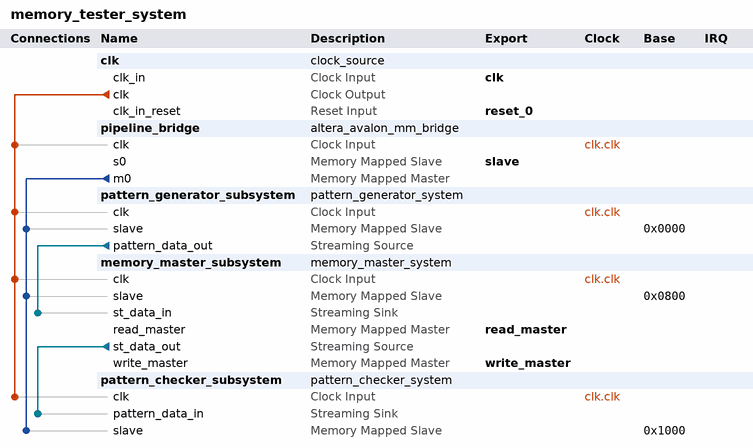
[diagram p0: system contents]
# Platform Designer (Qsys) system memory_tester_system
# Parameters at their usual value, and those the tool derives, are not listed.
package require -exact qsys 10.1
create_system memory_tester_system
set_project_property DEVICE_FAMILY CYCLONEIVE

add_instance clk clock_source 10.1
set_instance_parameter_value clk clockFrequency 50000000
set_instance_parameter_value clk clockFrequencyKnown false

add_instance pipeline_bridge altera_avalon_mm_bridge 10.1
set_instance_parameter_value pipeline_bridge DATA_WIDTH 32
set_instance_parameter_value pipeline_bridge ADDRESS_WIDTH 13
set_instance_parameter_value pipeline_bridge ADDRESS_UNITS SYMBOLS
set_instance_parameter_value pipeline_bridge BURSTCOUNT_UNITS SYMBOLS
set_instance_parameter_value pipeline_bridge MAX_PENDING_RESPONSES 4

add_instance pattern_generator_subsystem pattern_generator_system 1.0

add_instance memory_master_subsystem memory_master_system 1.0

add_instance pattern_checker_subsystem pattern_checker_system 1.0

# connections
add_connection clk.clk memory_master_subsystem.clk clock
add_connection clk.clk pattern_checker_subsystem.clk clock
add_connection clk.clk pattern_generator_subsystem.clk clock
add_connection clk.clk pipeline_bridge.clk clock
add_connection pipeline_bridge.m0 memory_master_subsystem.slave avalon
set_connection_parameter_value pipeline_bridge.m0/memory_master_subsystem.slave baseAddress 0x0800
add_connection pipeline_bridge.m0 pattern_checker_subsystem.slave avalon
set_connection_parameter_value pipeline_bridge.m0/pattern_checker_subsystem.slave baseAddress 0x1000
add_connection pipeline_bridge.m0 pattern_generator_subsystem.slave avalon
set_connection_parameter_value pipeline_bridge.m0/pattern_generator_subsystem.slave baseAddress 0x0000
add_connection memory_master_subsystem.st_data_out pattern_checker_subsystem.pattern_data_in avalon_streaming
add_connection pattern_generator_subsystem.pattern_data_out memory_master_subsystem.st_data_in avalon_streaming

# exported interfaces
add_interface reset_0 reset sink
set_interface_property reset_0 EXPORT_OF clk.clk_in_reset
add_interface clk clock sink
set_interface_property clk EXPORT_OF clk.clk_in
add_interface slave avalon slave
set_interface_property slave EXPORT_OF pipeline_bridge.s0
add_interface write_master avalon master
set_interface_property write_master EXPORT_OF memory_master_subsystem.write_master
add_interface read_master avalon master
set_interface_property read_master EXPORT_OF memory_master_subsystem.read_master

save_system memory_tester_system.qsys
